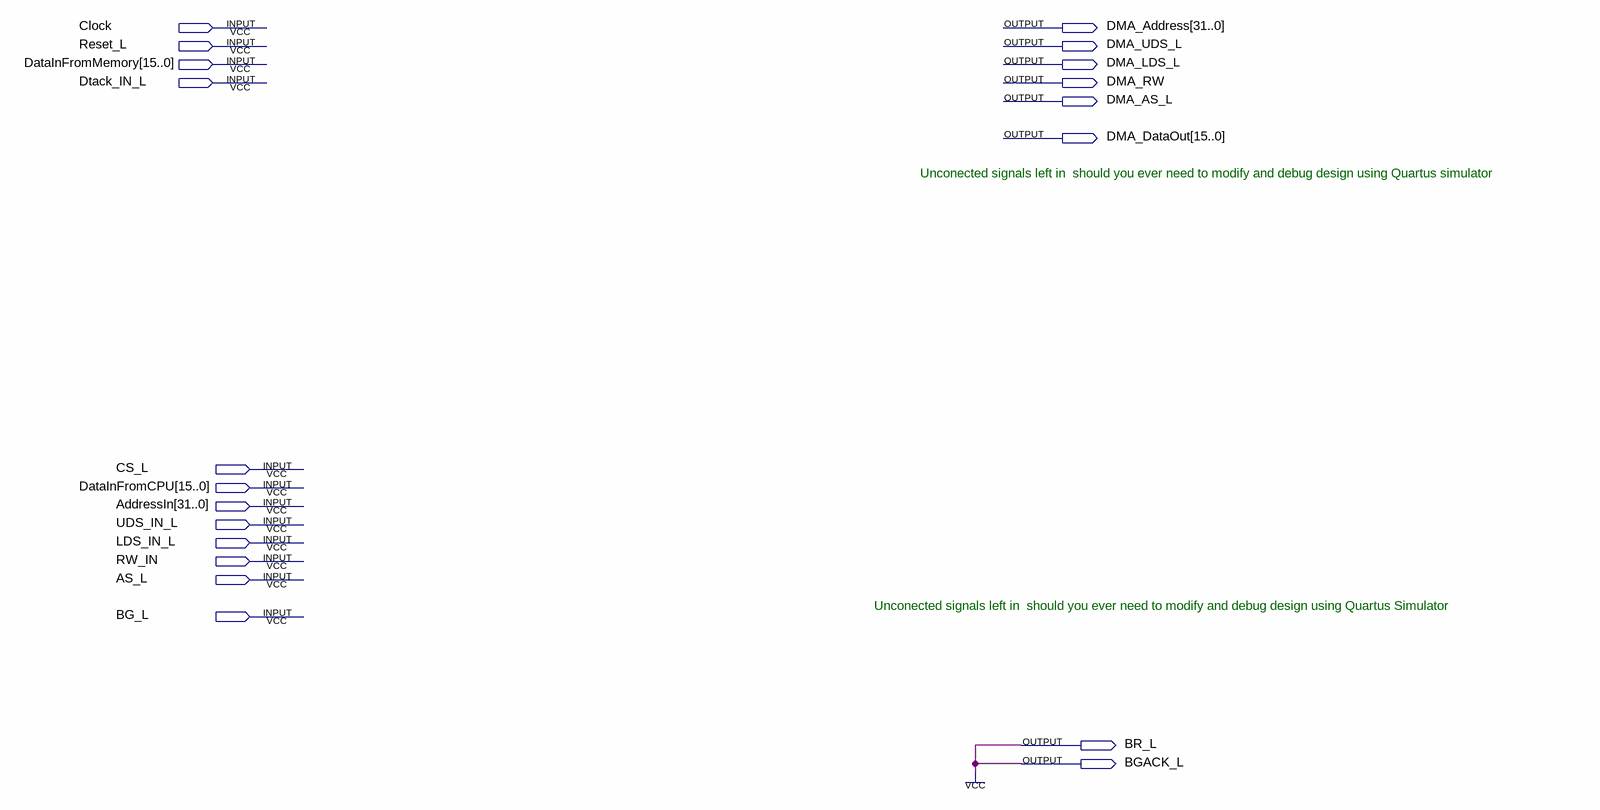
[diagram p0: schematic sheet]
// Quartus schematic DMAController.bdf as structural Verilog: 0 symbols, 20 pins
module DMAController (
  input  Clock,
  input  Reset_L,
  input  [15:0] DataInFromMemory,
  input  Dtack_IN_L,
  input  CS_L,
  input  [15:0] DataInFromCPU,
  input  [31:0] AddressIn,
  input  UDS_IN_L,
  input  LDS_IN_L,
  input  RW_IN,
  input  AS_L,
  input  BG_L,
  output [31:0] DMA_Address,
  output DMA_UDS_L,
  output DMA_LDS_L,
  output DMA_RW,
  output DMA_AS_L,
  output [15:0] DMA_DataOut,
  output BR_L,
  output BGACK_L
);


  assign BGACK_L = 1'b1;
  assign BR_L = 1'b1;

  // Notes on the sheet:
  //   Unconected signals left in  should you ever need to modify and debug design using Quartus simulator
  //   Unconected signals left in  should you ever need to modify and debug design using Quartus Simulator
endmodule
